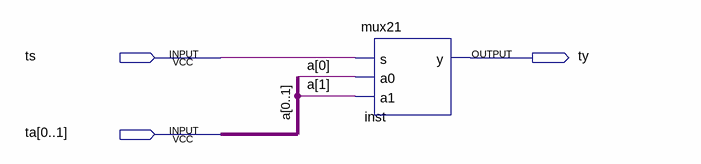
[diagram p0: schematic sheet]
// Quartus schematic mux21_sub.bdf as structural Verilog: 1 symbols, 3 pins
module mux21_sub (
  input  ts,
  input  [0:1] ta,
  output ty
);

  mux21 inst (.s(ts), .a0(ta[0]), .a1(ta[1]), .y(ty));

  // Other names for the same wires on the sheet: a[1:0] = {ta[1], ta[0]}
endmodule
